# EAGLE design iBolit_daughter (EAGLE 7.5.0)
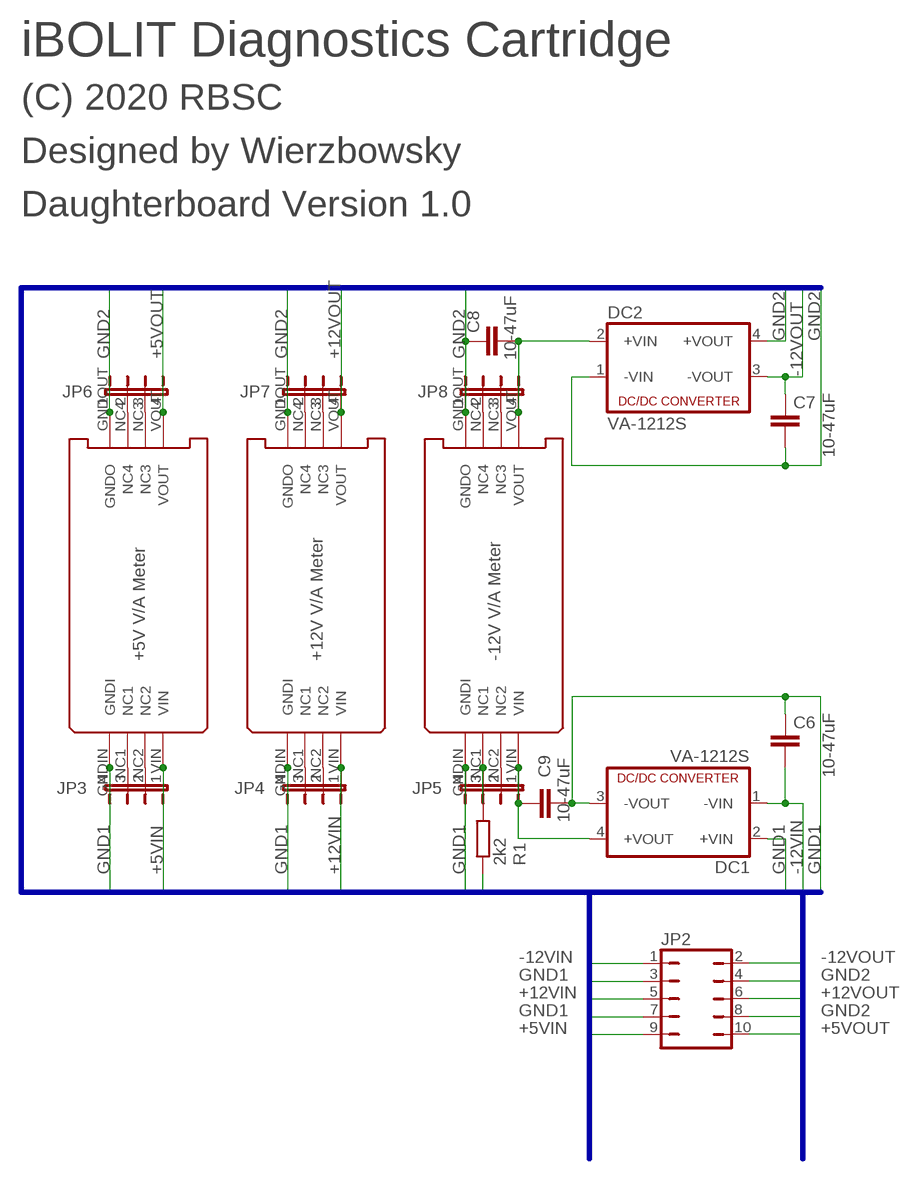
[diagram p0: schematic, sheet 1]

## Parts
C6  10-47uF  C-EUC1210  [C1210]
C7  10-47uF  C-EUC1210  [C1210]
C8  10-47uF  C-EUC1210  [C1210]
C9  10-47uF  C-EUC1210  [C1210]
DC1  VA-1212S  [4SIL]
DC2  VA-1212S  [4SIL]
JP2  JP5Q_CUSTOM  [JP5Q_CUSTOM]
JP3  JP4E_CUSTOM  [JP4_CUSTOM]
JP4  JP4E_CUSTOM  [JP4_CUSTOM]
JP5  JP4E_CUSTOM  [JP4_CUSTOM]
JP6  JP4E_CUSTOM  [JP4_CUSTOM]
JP7  JP4E_CUSTOM  [JP4_CUSTOM]
JP8  JP4E_CUSTOM  [JP4_CUSTOM]
R1  2k2  R-EU_R0805  [R0805]
X1  VA-METER  [VA_METER]
X2  VA-METER  [VA_METER]
X3  VA-METER  [VA_METER]

## Nets
+5VIN: JP2.9 JP3.1 R1.1 X1.VIN
+5VOUT: JP2.10 JP6.4 X1.VOUT
+12VCONVI: C9.1 DC1.4(+VOUT) JP5.1 X3.VIN
+12VCONVO: C8.2 DC2.2(+VIN) JP8.4 X3.VOUT
+12VIN: JP2.5 JP4.1 X2.VIN
+12VOUT: JP2.6 JP7.4 X2.VOUT
-12VIN: C6.2 DC1.1(-VIN) JP2.1
-12VOUT: C7.1 DC2.3(-VOUT) JP2.2
GND1: C6.1 C9.2 DC1.2(+VIN) DC1.3(-VOUT) JP2.3 JP2.7 JP3.4 JP4.4 JP5.4 X1.GNDIN(GNDI) X2.GNDIN(GNDI) X3.GNDIN(GNDI)
GND2: C7.2 C8.1 DC2.1(-VIN) DC2.4(+VOUT) JP2.4 JP2.8 JP6.1 JP7.1 JP8.1 X1.GNDOUT(GNDO) X2.GNDOUT(GNDO) X3.GNDOUT(GNDO)
N$45: JP8.2 X3.NC4
N$46: JP8.3 X3.NC3
N$47: JP5.2 X3.NC2
N$48: JP5.3 R1.2 X3.NC1
N$49: JP4.2 X2.NC2
N$51: JP3.2 X1.NC2
N$52: JP3.3 X1.NC1
N$53: JP6.2 X1.NC4
N$54: JP6.3 X1.NC3
N$55: JP7.2 X2.NC4
N$56: JP7.3 X2.NC3
N$57: JP4.3 X2.NC1

## Buses
D0,D1,D2,D3,D4,D5,D6,D7,A0,A1,A2,A3,A4,A5,A6,A7,A8,A9,A10,A11,A12,A13,A14,A15,SLTSL,RFSH,WAIT,INT,M1,BUSDIR,IORQ,MERQ,WR,RD,RESET,GND,CLOCK,SW1,SW2,CS1,CS2,CS12,SNDIN,GND1,GND2,+5V1,+5V2,+12V,-12V,+5VIN,+5VOUT,+12VIN,+12VOUT,-12VIN,-12VOUT

## Notes on the sheet
- iBOLIT Diagnostics Cartridge
- (C) 2020 RBSC
- Designed by Wierzbowsky
- Daughterboard Version 1.0
- +5V V/A Meter | +12V V/A Meter | -12V V/A Meter

## Library data of the parts
C6-C9 = rcl:C-EU: CAPACITOR, European symbol
DC1 DC2 = dc-dc-converter:VA-*?: DC DC Converter Single Output, 1 Watt Motien Technology Co.,Ltd. Source: Data sheet <http://www.motien.com.tw/data_sheet/VA-1%28H%29.pdf>; OC_FARNELL: unknown; OC_NEWARK: unknown
JP2 = jumper_custom:JP5Q_CUSTOM: JUMPER
JP3-JP8 = jumper_custom:JP4E_CUSTOM: JUMPER
R1 = resistor:R-EU_: RESISTOR, European symbol
X1-X3 = va_meter:VA-METER: Volt-Amp Meter

## Board
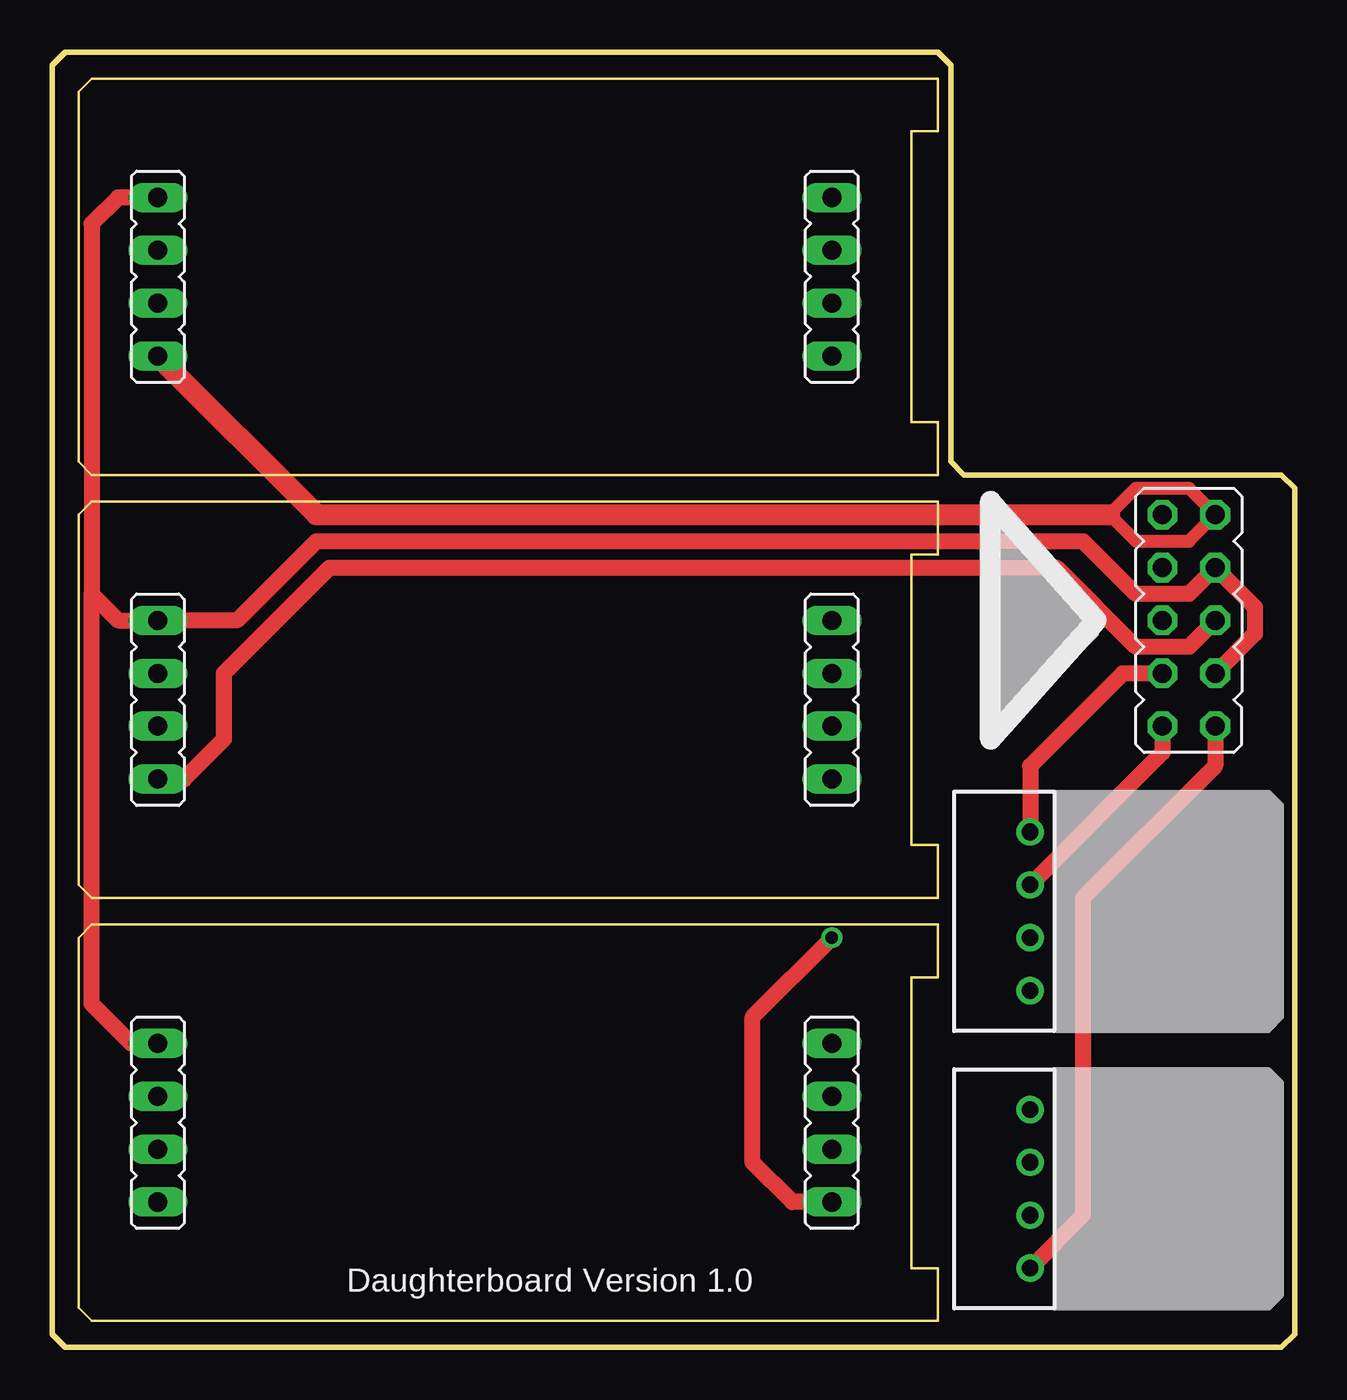
[diagram p1: board, top side]
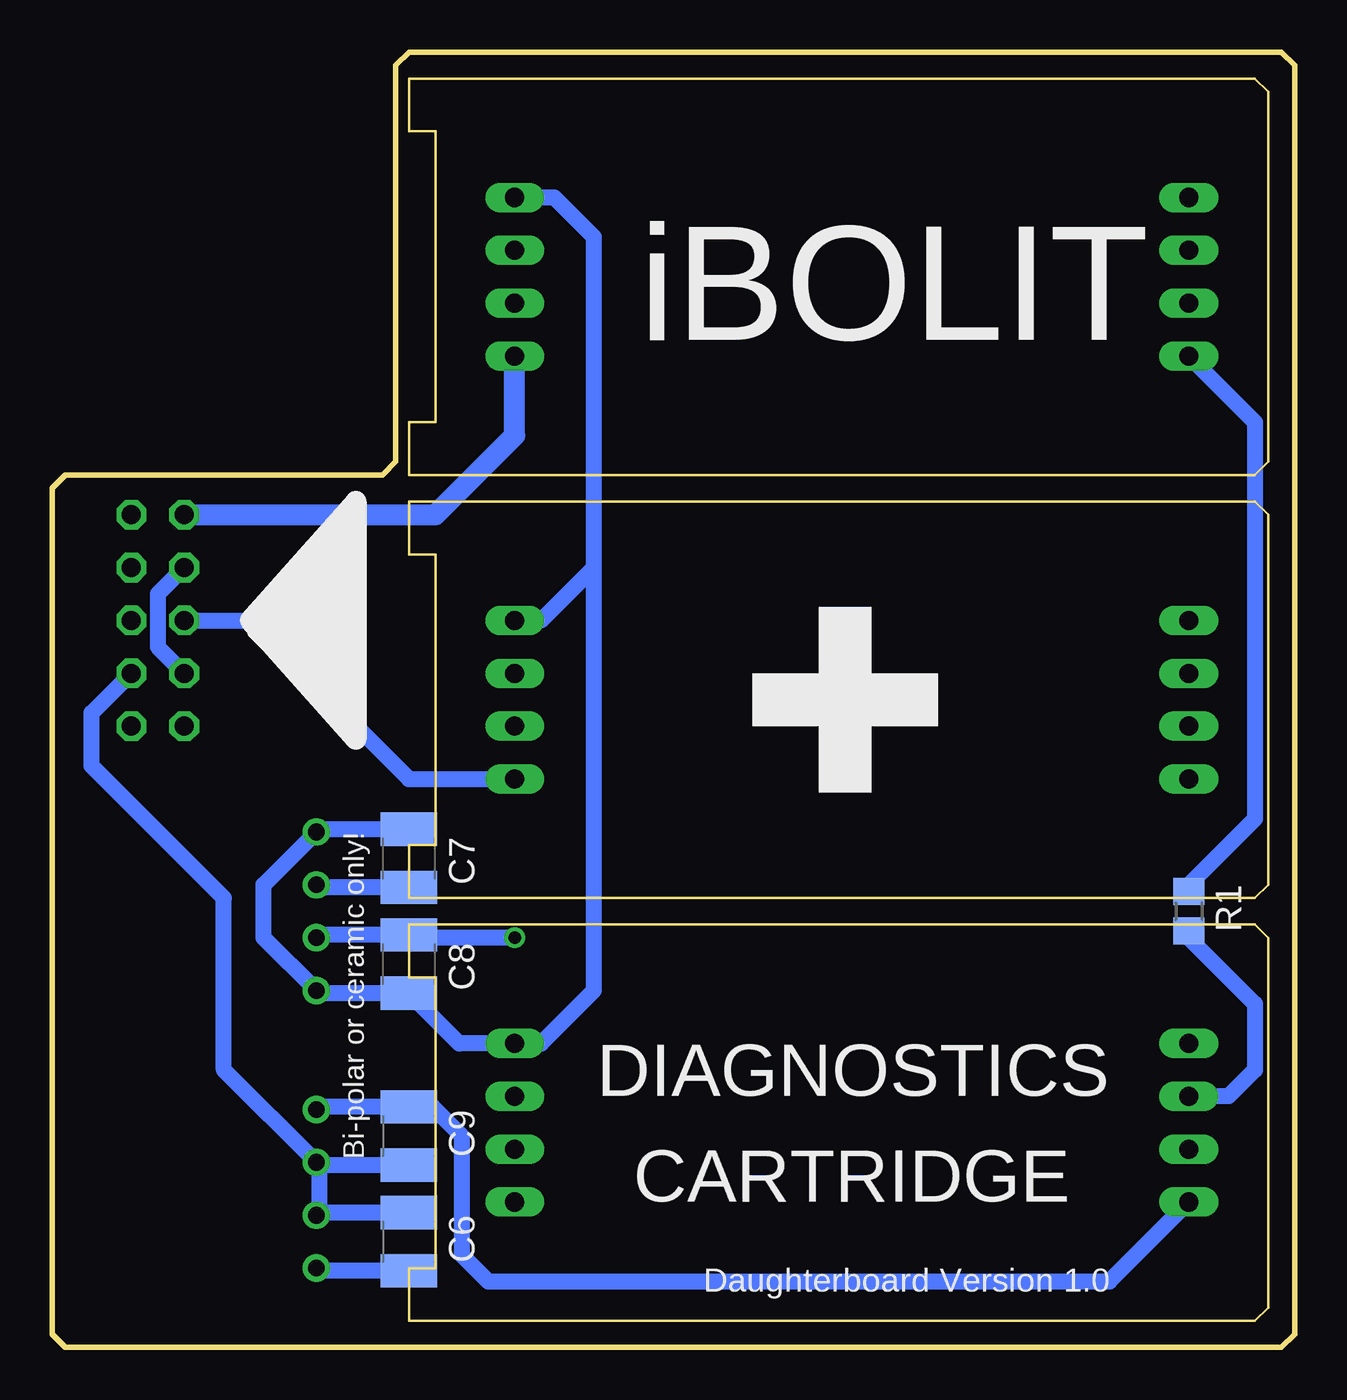
[diagram p2: board, bottom side, seen from below]

Size 59.69 x 62.23 mm. Coordinates in mm from the lower left corner, seen from the top.
Outline: 59.05,41.91 43.81,41.91 43.18,42.54 43.18,61.6 42.55,62.23 0.63,62.23 0,61.6 0,0.63 0.63,0 59.05,0 59.69,0.63 59.69,41.27 59.05,41.91
Copper layers (1*16): Top 0.035mm / dielectric 1.5mm / Bottom 0.035mm
Design rules "default *": minimum track width 10mil, minimum drill 24mil, track to track 8mil, track to pad 8mil, pad to pad 8mil, via to via 8mil, smd to smd 8mil, copper to edge 10mil, drill to drill 8mil, minimum pad ring 10mil, minimum via ring 8mil, stop-mask expansion 4mil, vias tented up to drill 25mil, thermal gap 20mil

### Footprints (pad centres in the part's own frame; a part is rotated, then mirrored left to right if it is on the bottom)
C1210 = smd 1.6 x 2.7: 1 -1.4,0; 2 1.4,0
4SIL = drill 0.8: 1 -3.81,0; 2 -1.27,0; 3 1.27,0; 4 3.81,0
JP5Q_CUSTOM = drill 0.914 octagon: 1 -5.08,-1.27; 2 -5.08,1.27; 3 -2.54,-1.27; 4 -2.54,1.27; 5 0,-1.27; 6 0,1.27; 7 2.54,-1.27; 8 2.54,1.27; 9 5.08,-1.27; 10 5.08,1.27
JP4_CUSTOM = drill 0.914 long: 1 -3.81,0; 2 -1.27,0; 3 1.27,0; 4 3.81,0
R0805 = smd 1.3 x 1.5: 1 -0.95,0; 2 0.95,0
VA_METER = drill 0.8 square: GNDIN -6.35,4.445; GNDOUT 26.035,4.445; NC1 -6.35,1.905; NC2 -6.35,-0.635; NC3 26.035,-0.635; NC4 26.035,1.905; VIN -6.35,-3.175; VOUT 26.035,-3.175

### Placement (x,y rotation side)
C6  42.55,5.08 270 bottom
C7  42.55,23.49 90 bottom
C8  42.55,18.41 90 bottom
C9  42.55,10.16 270 bottom
DC1  46.99,7.62 90 top
DC2  46.99,20.96 90 top
JP2  54.61,34.93 90 top
JP3  5.08,51.43 90 top
JP4  5.08,31.12 90 top
JP5  5.08,10.79 90 top
JP6  37.46,51.43 270 top
JP7  37.46,31.12 270 top
JP8  37.46,10.79 270 top
R1  5.08,20.96 270 bottom
X1  11.43,50.8 0 top
X2  11.43,30.48 0 top
X3  11.43,10.16 0 top

### Tracks (layer width: path | path; a pad name or v marks a point on that pad's centre or on a via)
+5VIN
  Top 0.635: 50.8,40.01 52.07,41.27 54.61,41.27 JP2.9 54.61,38.74 52.07,38.74 50.8,40.01
  Top 1.016: X1.VIN 12.7,40.01 50.8,40.01
  Bottom 0.762: X1.VIN 1.91,44.45 1.91,25.4 5.08,22.23 R1.1
+5VOUT
  Bottom 1.016: JP2.10 41.27,40.01 37.46,43.82 JP6.4
+12VCONVI
  Bottom 0.762: DC1.4 46.86,11.56 C9.1 41.41,11.56 40,10.16 40,4.45 38.73,3.18 8.89,3.18 X3.VIN
+12VCONVO  (via drill 0.6)
  Top 0.762: JP8.4 35.56,6.99 33.66,8.89 33.66,15.88 v37.46,19.68
  Bottom 0.762: DC2.2 46.86,19.82 C8.2 42.41,19.68 v37.46,19.68
+12VIN
  Top 0.762: JP4.1 6.35,27.3 8.25,29.21 8.25,32.38 13.34,37.46 48.26,37.46 52.07,33.66 54.61,33.66 JP2.5
+12VOUT
  Bottom 0.762: JP2.6 50.16,34.93 42.55,27.3 JP7.4
-12VIN
  Top 0.762: JP2.1 55.88,27.94 49.53,21.59 49.53,6.35 DC1.1
  Bottom 0.762: C6.2 46.86,3.68 DC1.1
-12VOUT
  Top 0.762: JP2.2 53.34,28.57 DC2.3
  Bottom 0.762: C7.1 46.86,22.1 DC2.3
GND1
  Top 0.762: JP3.4 3.17,55.24 1.91,53.98 1.91,36.2 | 1.91,36.2 3.17,34.93 JP4.4 8.89,34.93 12.7,38.74 49.53,38.74 52.07,36.2 54.61,36.2 JP2.7 57.78,35.56 57.78,34.29 JP2.3 | JP5.4 3.81,14.6 1.91,16.51 1.91,36.2
  Bottom 0.762: C9.2 46.86,8.76 | 46.86,8.76 DC1.3 51.43,13.34 51.43,21.59 57.78,27.94 57.78,30.48 JP2.3 | C6.1 46.86,6.48 | 46.86,8.76 46.86,6.48 | 46.86,6.48 DC1.2
GND2
  Top 0.762: JP2.4 51.43,32.38 46.99,27.94 DC2.4
  Bottom 0.762: JP7.1 36.19,34.93 33.66,37.46 | 33.66,37.46 33.66,53.34 35.56,55.24 JP6.1 | 33.66,37.46 33.66,17.15 36.19,14.6 JP8.1 40.13,14.6 C8.1 46.86,17.02 DC2.1 49.53,19.68 49.53,22.23 DC2.4 46.86,24.9 C7.2 | JP2.8 54.61,36.2 54.61,33.66 JP2.4
N$48
  Bottom 0.762: R1.2 5.08,19.68 1.91,16.51 1.91,13.34 3.17,12.07 X3.NC1

### Text on the board
tNames: Daughterboard Version 1.0
bNames: iBOLIT | Bi-polar or ceramic only! | DIAGNOSTICS | CARTRIDGE | Daughterboard Version 1.0